# Altium project USB Power.PrjPCB
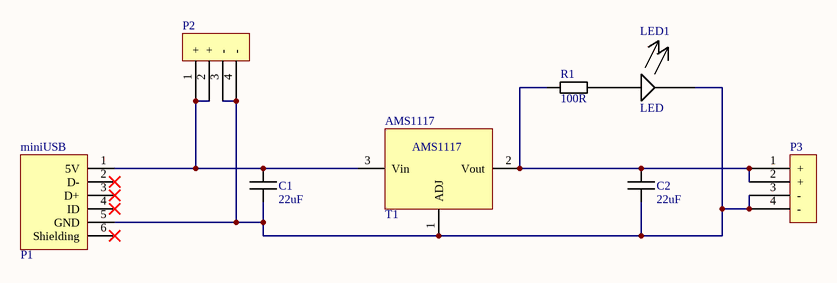
[diagram p0: USB Power.SchDoc]
1 sheet, 8 parts. Net scope: global (net labels, ports and power ports of the same name join across sheets).
Board file: USB Power.PcbDoc

## Sheet USB Power.SchDoc
size A4

### Parts
AMS1117  T1  [SOT-223]
C1  22uF  [0805-C]
C2  22uF  [0805-C]
LED1  LED  [LED 3mm]
miniUSB  P1  [miniUSB]
P2  Header 1x4 ++--  [Header 4x1 long]  (value not drawn)
P3  Header 1x4 ++--  [Header 4x1 long]  (value not drawn)
R1  100R  [R 0805 / 2012]

### Nets
NetAMS1117_1: AMS1117.1(ADJ) C1.1 C2.1 LED1.2(-) miniUSB.5(GND) P2.3(-) P2.4(-) P3.3(-) P3.4(-)
NetAMS1117_2: AMS1117.2(Vout) C2.2 P3.1(+) P3.2(+) R1.1
NetAMS1117_3: AMS1117.3(Vin) C1.2 miniUSB.1(5V) P2.1(+) P2.2(+)
NetLED1_1: LED1.1(+) R1.2

Not connected (* = marked no-connect by the designer): miniUSB 2(D-)* 3(D+)* 4(ID)* 6(Shielding)*

### Library data of the parts
AMS1117 = AMS1117
C1 C2 = Capacitor
miniUSB = miniUSB
R1 = Resistor